# Altium schematic sheet Onboard_LEDs.SchDoc
size A4; DocumentNumber: 8; SheetNumber: 8; SheetTotal: 9
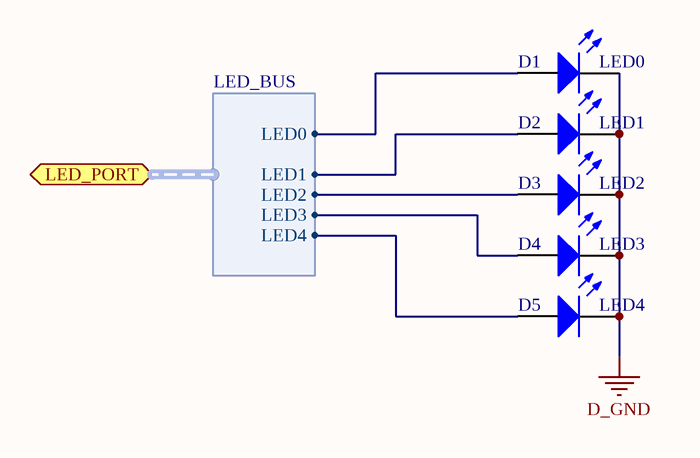
[diagram p0: Onboard_LEDs.SchDoc]

## Parts
D1  LED0  [LEDCP1006X02N]
D2  LED1  [LEDCP1006X02N]
D3  LED2  [LEDCP1006X02N]
D4  LED3  [LEDCP1006X02N]
D5  LED4  [LEDCP1006X02N]

## Ports
LED_PORT (harness LED_BUS)

## Harnesses
LED_BUS: LED0, LED1, LED2, LED3, LED4

## Nets
D_GND: D1.2(K) D2.2(K) D3.2(K) D4.2(K) D5.2(K)
NetD1_1: D1.1(A) ; port LED_PORT.LED0
NetD2_1: D2.1(A) ; port LED_PORT.LED1
NetD3_1: D3.1(A) ; port LED_PORT.LED2
NetD4_1: D4.1(A) ; port LED_PORT.LED3
NetD5_1: D5.1(A) ; port LED_PORT.LED4

## Library data of the parts
D1-D5 = LED0: Typical INFRARED GaAs LED; Published: 8-Jun-2000; LatestRevisionDate: 08-Jul-2005; LatestRevisionNote: Mech Layer 1 removed.; PackageReference: LED-0; Publisher: Altium Limited; PackageDescription: LED; 2 Leads